# EAGLE schematic nv-h5b (EAGLE 9.6.2)
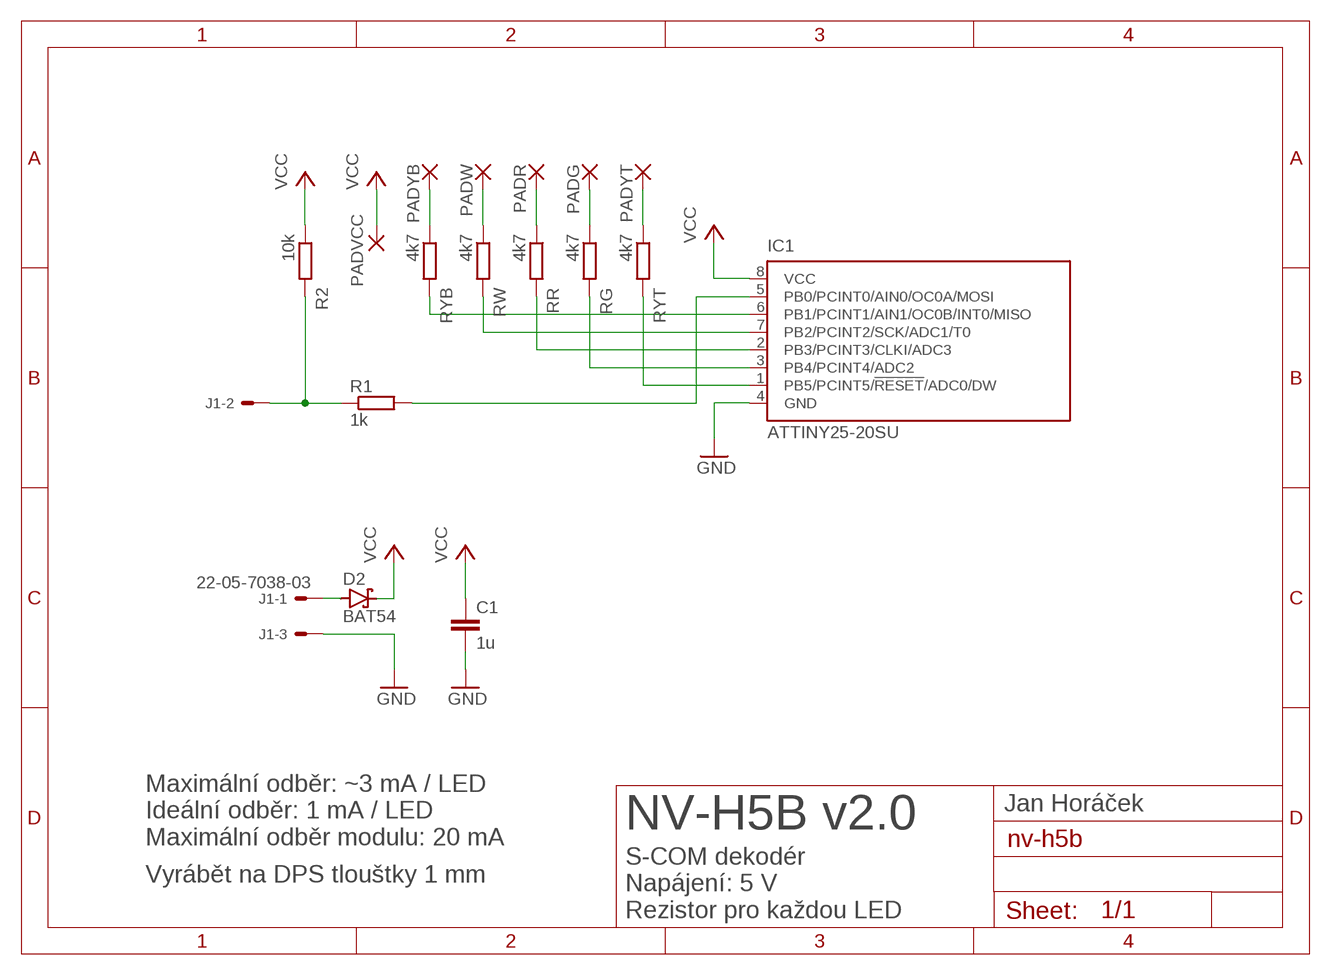
[diagram p0: schematic, sheet 1]

## Parts
C1  1u  C-EUC0805  [C0805]
D2  BAT54  [SOT23]
IC1  ATTINY25-20SU  TINY13-20SSU  [8S1]
J1  22-05-7038-03  [7395-03]
PADG  SMD3  [SMD1,778-5,08]
PADR  SMD3  [SMD1,778-5,08]
PADVCC  SMD3  [SMD1,778-5,08]
PADW  SMD3  [SMD1,778-5,08]
PADYB  SMD3  [SMD1,778-5,08]
PADYT  SMD3  [SMD1,778-5,08]
R1  1k  R-EU_R0805  [R0805]
R2  10k  R-EU_R0805  [R0805]
RG  4k7  R-EU_R0805  [R0805]
RR  4k7  R-EU_R0805  [R0805]
RW  4k7  R-EU_R0805  [R0805]
RYB  4k7  R-EU_R0805  [R0805]
RYT  4k7  R-EU_R0805  [R0805]

## Nets
DATAIN: J1.2 R1.1 R2.2
DATAIN_: IC1.5(PB0/PCINT0/AIN0/OC0A/MOSI) R1.2
GND: C1.2 IC1.4(GND) J1.3
GREEN: PADG.1(P) RG.1
N$3: IC1.6(PB1/PCINT1/AIN1/OC0B/INT0/MISO) RYB.2
N$4: IC1.3(PB4/PCINT4/ADC2) RG.2
N$5: IC1.1(PB5/PCINT5/!RESET!/ADC0/DW) RYT.2
N$6: IC1.7(PB2/PCINT2/SCK/ADC1/T0) RW.2
N$7: IC1.2(PB3/PCINT3/CLKI/ADC3) RR.2
RED: PADR.1(P) RR.1
VCC: C1.1 D2.3(C) IC1.8(VCC) PADVCC.1(P) R2.1
VIN: D2.1(A) J1.1
WHITE: PADW.1(P) RW.1
YEL-BOT: PADYB.1(P) RYB.1
YEL-TOP: PADYT.1(P) RYT.1

## Notes on the sheet
- Jan Horáček
- NV-H5B v2.0
- Maximální odběr: ~3 mA / LED
  Ideální odběr: 1 mA / LED
  Maximální odběr modulu: 20 mA
- Vyrábět na DPS tlouštky 1 mm
- S-COM dekodér
  Napájení: 5 V
  Rezistor pro každou LED

## Library data of the parts
C1 = rcl:C-EU: CAPACITOR, European symbol
D2 = diode:BAT54: Schottky Diodes Source: Fairchild .. BAT54.pdf
IC1 = atmel:TINY13: 8-bit AVR Microcontroller with 1K Bytes In-System Programmable Flash Source: http://www.atmel.com/dyn/resources/prod_documents/2535S.pdf; MPN: ATTINY13-20SSU; OC_FARNELL: 1455133; OC_NEWARK: 58M3771
J1 = con-molex:22-?-03: CONNECTOR wire to board 2.54 mm (.1 inch) pitch header; MF: MOLEX; OC_FARNELL: unknown; OC_NEWARK: unknown
PADG PADR PADVCC PADW PADYB PADYT = wirepad:SMD3
R1 R2 RG RR RW RYB RYT = rcl:R-EU_: RESISTOR, European symbol

## Net classes
0 default: width 0.305 mm